# EasyEDA schematic SCH_Line Following Robot Interrupt_2023-12-08.json
TITLE: Line Following Robot; REV: 1.0; Date: 2023-10-19; Sheet: 1/1; Drawn By: Simon Raman; Company: HOGENT
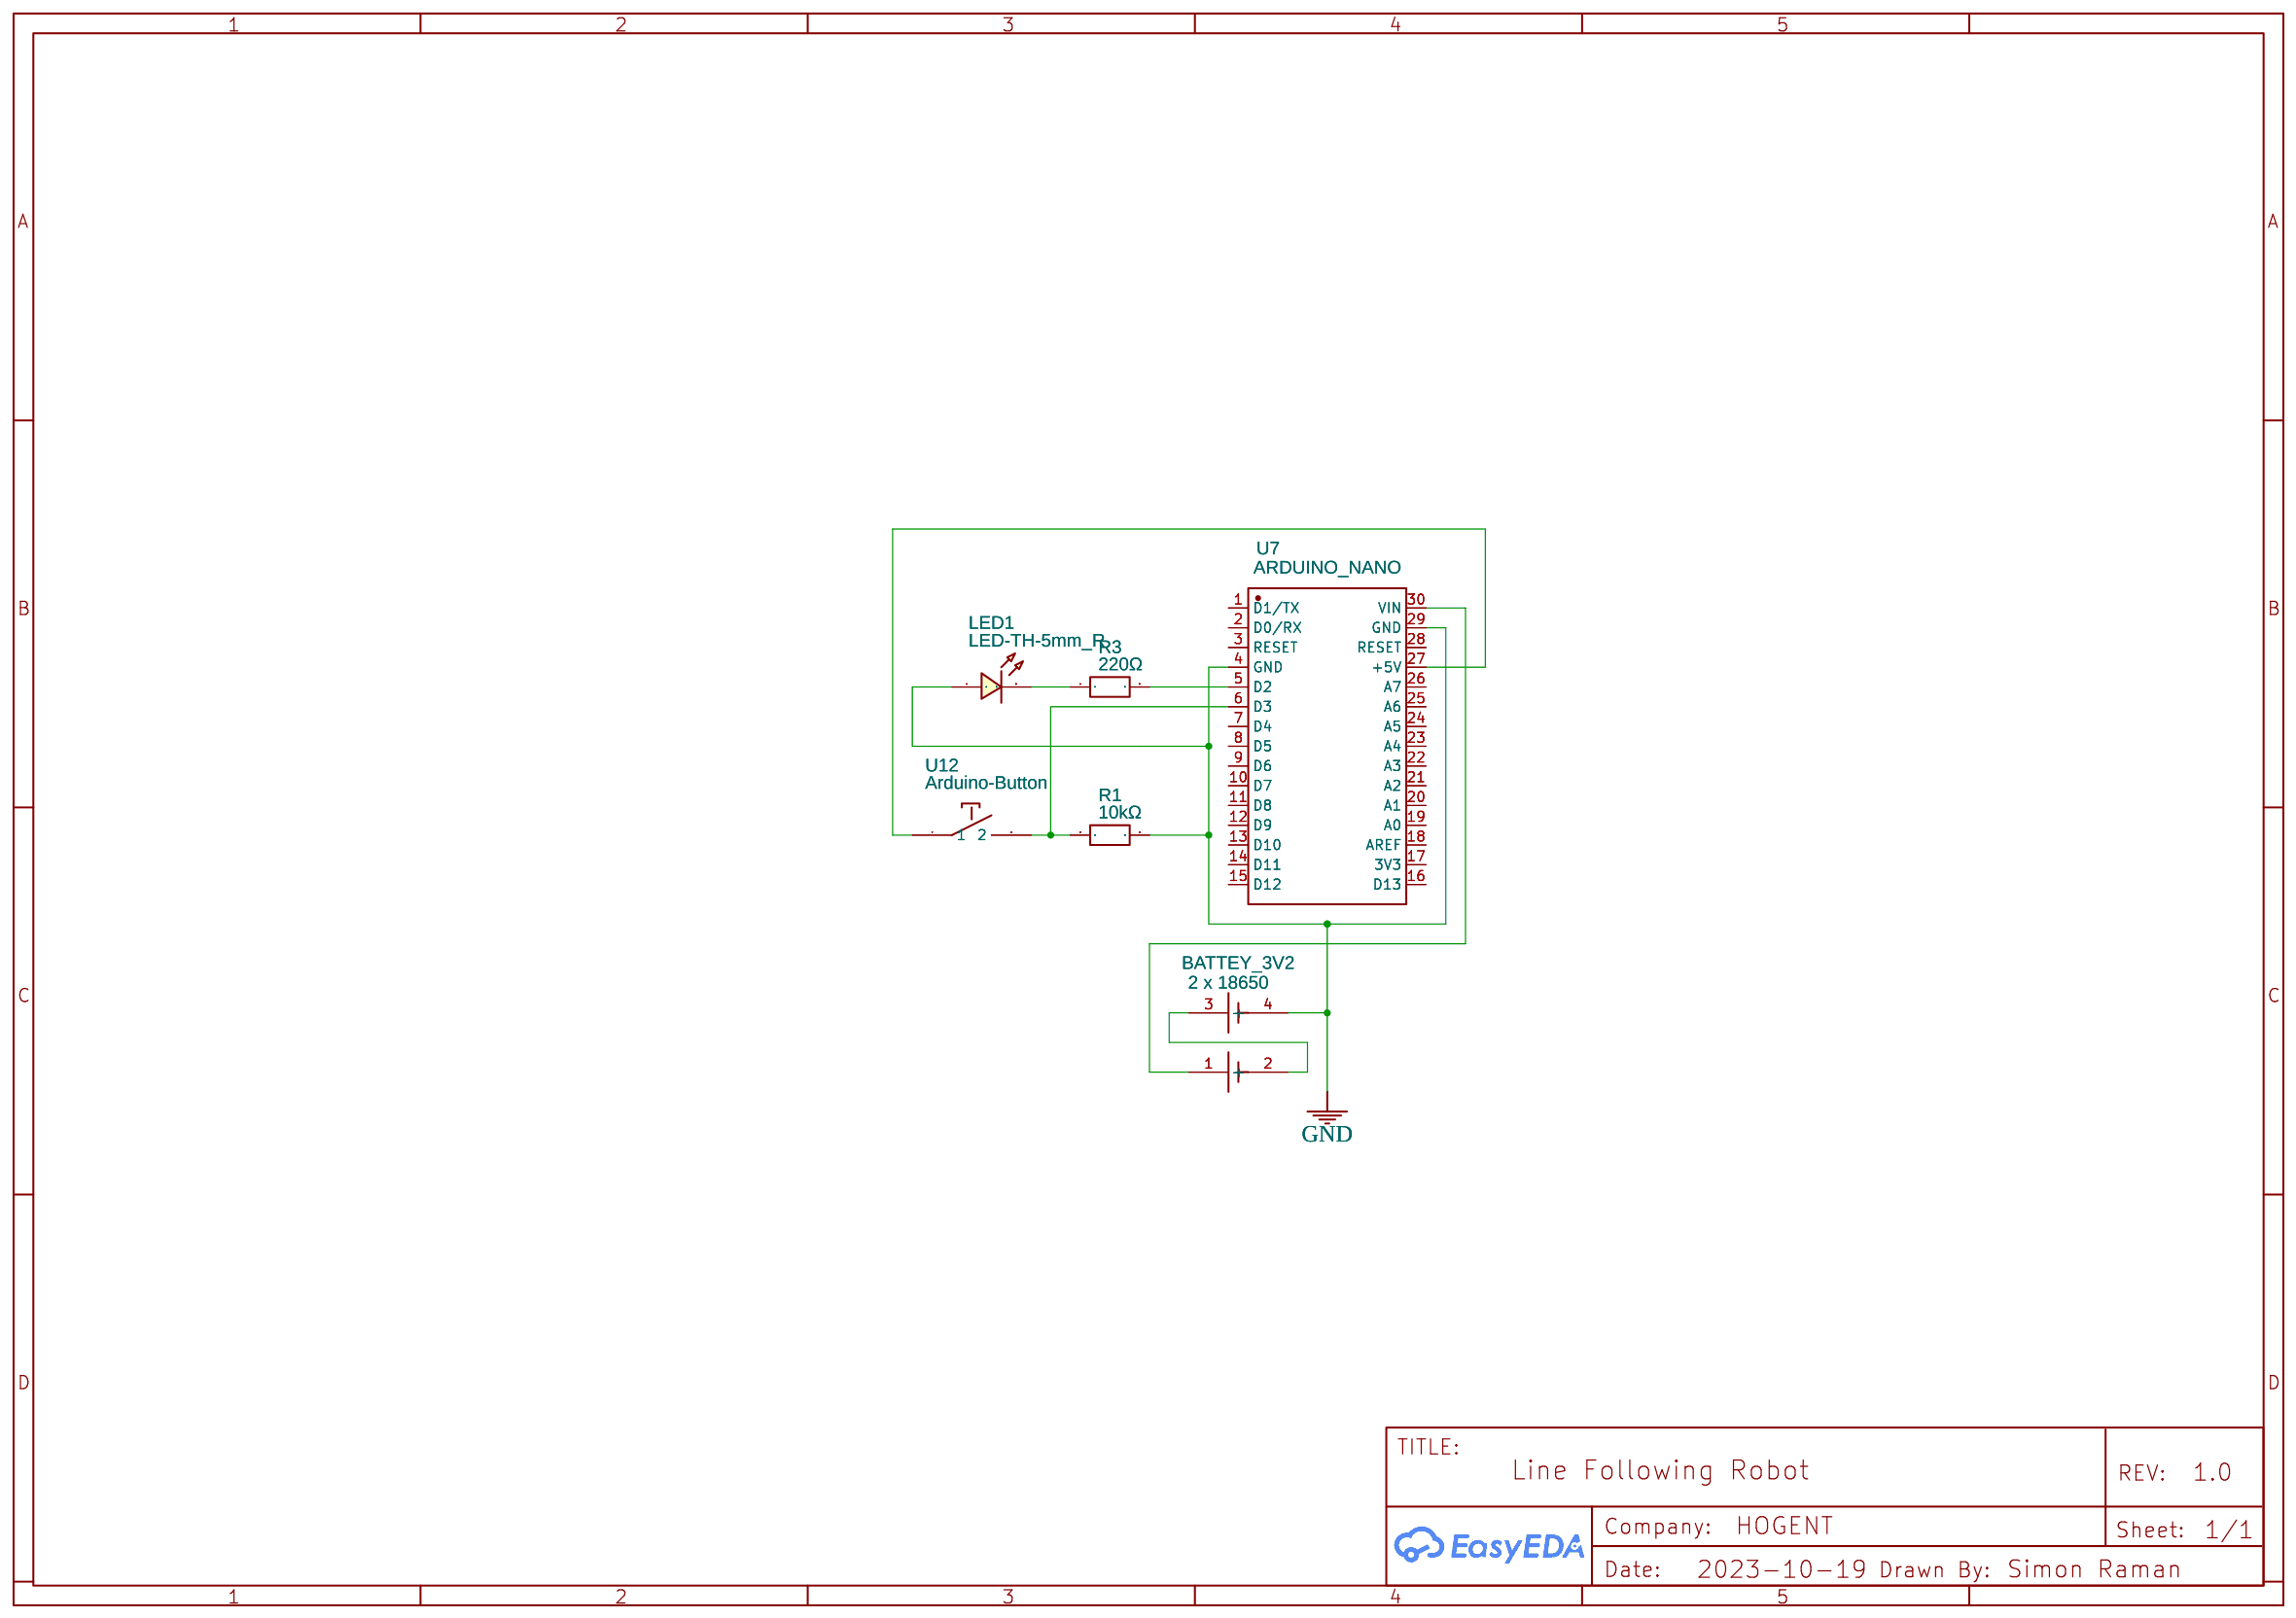
[diagram p0: schematic sheet]

## Parts
BATTEY_3V2  2 x 18650  [MPD_BK_18650_PC4]
LED1  LED-TH-5mm_R  [LED-TH_BD5.0_RED]
R1  10kΩ  [AXIAL RESISTOR 220 OHM - TH_BD2.3-L6.0-P10.00-D0.4]
R3  220Ω  [AXIAL RESISTOR 220 OHM - TH_BD2.3-L6.0-P10.00-D0.4]
U7  ARDUINO_NANO  [COMM-TH_ARDUINO_NANO]
U12  Arduino-Button  [ARDUINOBUTTON_SCHEMATIC]

## Library data of the parts
BATTEY_3V2 = BAT_X2_18650: Manufacturer: Dex; Supplier: Dex; Supplier Part: BAT_X2; Contributor: MSeb
LED1 = LED-TH-5mm_R: Manufacturer: EVERLIGHT(台湾亿光); Manufacturer Part: 333-2SURD/S530-A3; Supplier Part: C87271; Supplier: LCSC; Contributor: LCEDA_Lib
R1 R3 = AXIAL RESISTOR 220 OHM - TH_BD2.3-L6.0-P10.00-D0.4: Contributor: Waleed Kies; JLCPCB Part Class: Extended Part
U7 = ARDUINO_NANO: Contributor: lcsc; Supplier: LCSC; Supplier Part: C9900017879; Manufacturer: null; JLCPCB Part Class: Extended Part; link: https://lcsc.com/eda_search?q=C9900017879&%26type=1&ref=editor
U12 = Arduino-Button: Manufacturer Part: SW100664; Supplier Part: SW100664; Contributor: RasenderReporter

## Nets
GND: BATTEY_3V2.4(-) LED1.1 R1.2 U7.4(GND) U7.29(GND)
Net-(BATTEY_3V2-1): BATTEY_3V2.1(+) U7.30(VIN)
Net-(BATTEY_3V2-2): BATTEY_3V2.2(-) BATTEY_3V2.3(+)
Net-(LED1-2): LED1.2 R3.1
Net-(R1-1): R1.1 U7.6(D3) U12.2
Net-(R3-2): R3.2 U7.5(D2)
Net-(U7-27): U7.27(+5V) U12.1

Not connected (* = marked no-connect by the designer): U7 1(D1/TX) 2(D0/RX) 3(RESET) 7(D4) 8(D5) 9(D6) 10(D7) 11(D8) 12(D9) 13(D10) 14(D11) 15(D12) 16(D13) 17(3V3) 18(AREF) 19(A0) 20(A1) 21(A2) 22(A3) 23(A4) 24(A5) 25(A6) 26(A7) 28(RESET)
